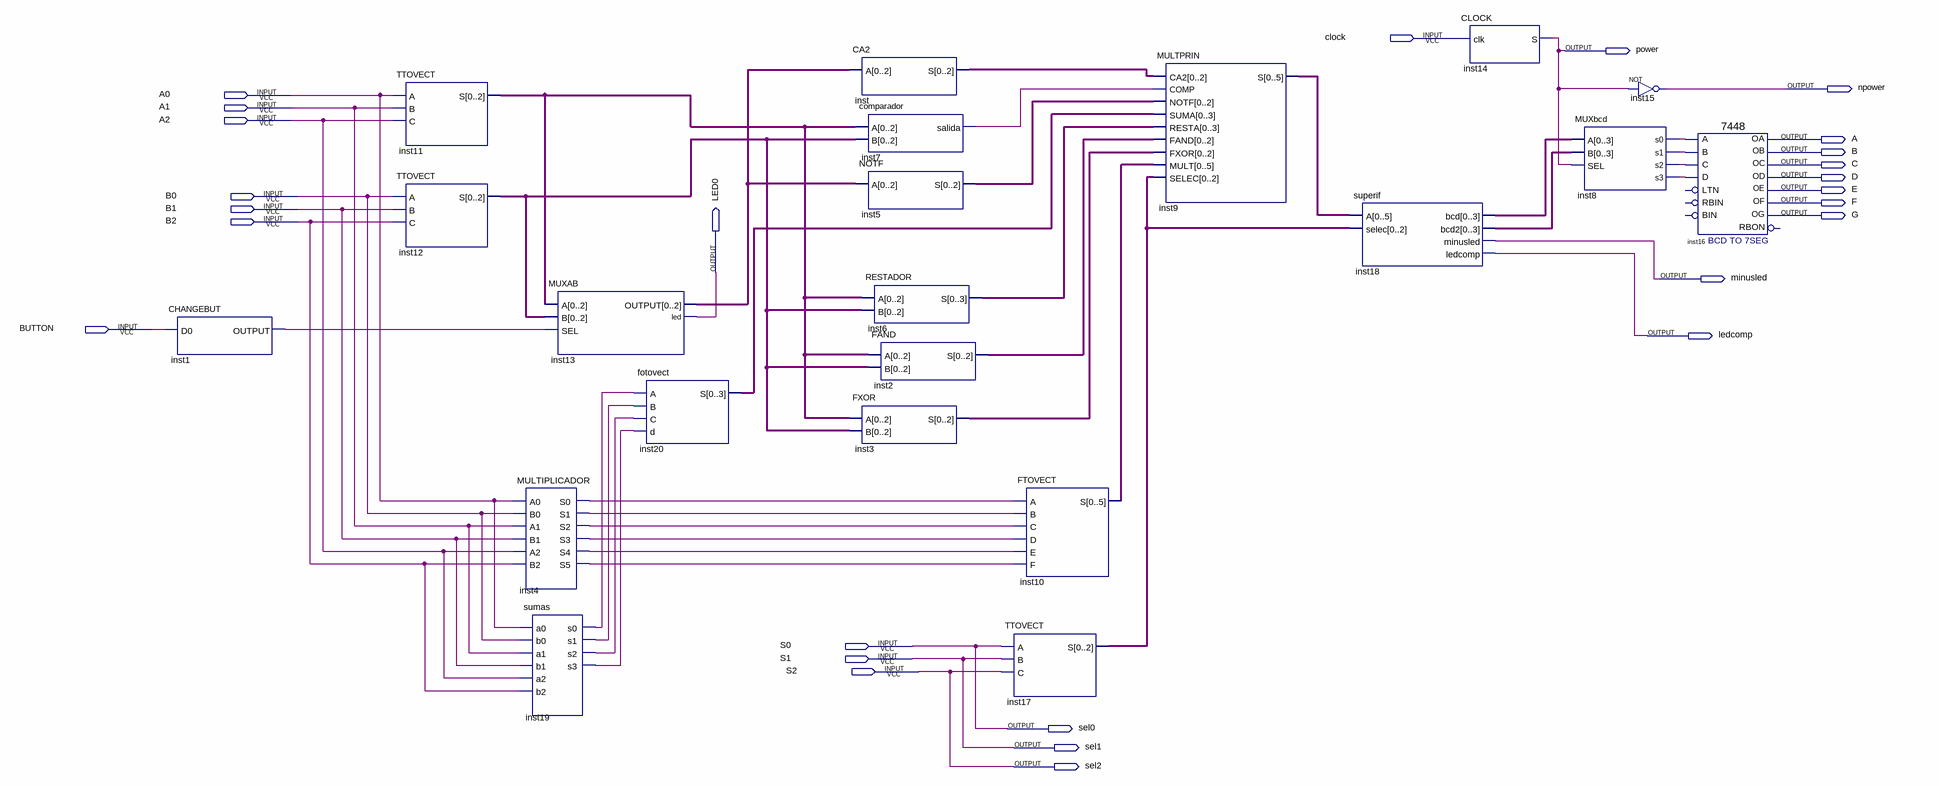
[diagram p0: schematic sheet]
// Quartus schematic PRIN.bdf as structural Verilog: 21 symbols, 26 pins
module PRIN (
  input  clock,
  input  A0,
  input  A1,
  input  A2,
  input  B0,
  input  B1,
  input  B2,
  input  BUTTON,
  input  S0,
  input  S1,
  input  S2,
  output power,
  output npower,
  output A,
  output B,
  output C,
  output D,
  output E,
  output F,
  output G,
  output LED0,
  output minusled,
  output ledcomp,
  output sel0,
  output sel1,
  output sel2
);

  wire inst1_output, inst4_s0, inst4_s1, inst4_s2, inst4_s3, inst4_s4, inst4_s5, inst7_salida, inst8_s0,
       inst8_s1, inst8_s2, inst8_s3, inst19_s0, inst19_s1, inst19_s2, inst19_s3;
  wire [2:0] inst2_s, inst3_s, inst5_s, inst11_s, inst12_s, inst13_output, inst17_s, inst_s;
  wire [3:0] inst6_s, inst18_bcd, inst18_bcd2, inst20_s;
  wire [5:0] inst9_s, inst10_s;

  CHANGEBUT inst1 (.D0(BUTTON), .OUTPUT(inst1_output));
  TTOVECT inst11 (.A(A0), .B(A1), .C(A2), .S(inst11_s));
  TTOVECT inst12 (.A(B0), .B(B1), .C(B2), .S(inst12_s));
  MUXAB inst13 (.A(inst11_s), .B(inst12_s), .SEL(inst1_output), .OUTPUT(inst13_output), .led(LED0));
  MULTIPLICADOR inst4 (
    .A0(A0), .B0(B0), .A1(A1), .B1(B1), .A2(A2), .B2(B2), .S0(inst4_s0), .S1(inst4_s1), .S2(inst4_s2),
    .S3(inst4_s3), .S4(inst4_s4), .S5(inst4_s5));
  sumas inst19 (
    .a0(A0), .b0(B0), .a1(A1), .b1(B1), .a2(A2), .b2(B2), .s0(inst19_s0), .s1(inst19_s1), .s2(inst19_s2),
    .s3(inst19_s3));
  fotovect inst20 (.A(inst19_s0), .B(inst19_s1), .C(inst19_s2), .d(inst19_s3), .S(inst20_s));
  CA2 inst (.A(inst13_output), .S(inst_s));
  comparador inst7 (.A(inst11_s), .B(inst12_s), .salida(inst7_salida));
  NOTF inst5 (.A(inst13_output), .S(inst5_s));
  FXOR inst3 (.A(inst11_s), .B(inst12_s), .S(inst3_s));
  RESTADOR inst6 (.A(inst11_s), .B(inst12_s), .S(inst6_s));
  FAND inst2 (.A(inst11_s), .B(inst12_s), .S(inst2_s));
  TTOVECT inst17 (.A(S0), .B(S1), .C(S2), .S(inst17_s));
  FTOVECT inst10 (.A(inst4_s0), .B(inst4_s1), .C(inst4_s2), .D(inst4_s3), .E(inst4_s4), .F(inst4_s5), .S(inst10_s));
  MULTPRIN inst9 (
    .CA2(inst_s), .COMP(inst7_salida), .NOTF(inst5_s), .SUMA(inst20_s), .RESTA(inst6_s), .FAND(inst2_s),
    .FXOR(inst3_s), .MULT(inst10_s), .SELEC(inst17_s), .S(inst9_s));
  superif inst18 (
    .A(inst9_s), .selec(inst17_s), .bcd(inst18_bcd), .bcd2(inst18_bcd2), .minusled(minusled),
    .ledcomp(ledcomp));
  CLOCK inst14 (.clk(clock), .S(power));
  MUXbcd inst8 (
    .A(inst18_bcd), .B(inst18_bcd2), .SEL(power), .s0(inst8_s0), .s1(inst8_s1), .s2(inst8_s2), .s3(inst8_s3));
  not inst15 (npower, power);
  \7448  inst16 (
    .A(inst8_s0), .C(inst8_s2), .D(inst8_s3), .B(inst8_s1), .OC(C), .OE(E), .OD(D), .OF(F), .OG(G), .OB(B),
    .OA(A));  // open: RBIN, BIN, LTN, RBON

  assign sel0 = S0;
  assign sel1 = S1;
  assign sel2 = S2;
endmodule
